# Altium schematic sheet Signal Conditioning.SchDoc
size A4; SheetNumber: 4; SheetTotal: 4
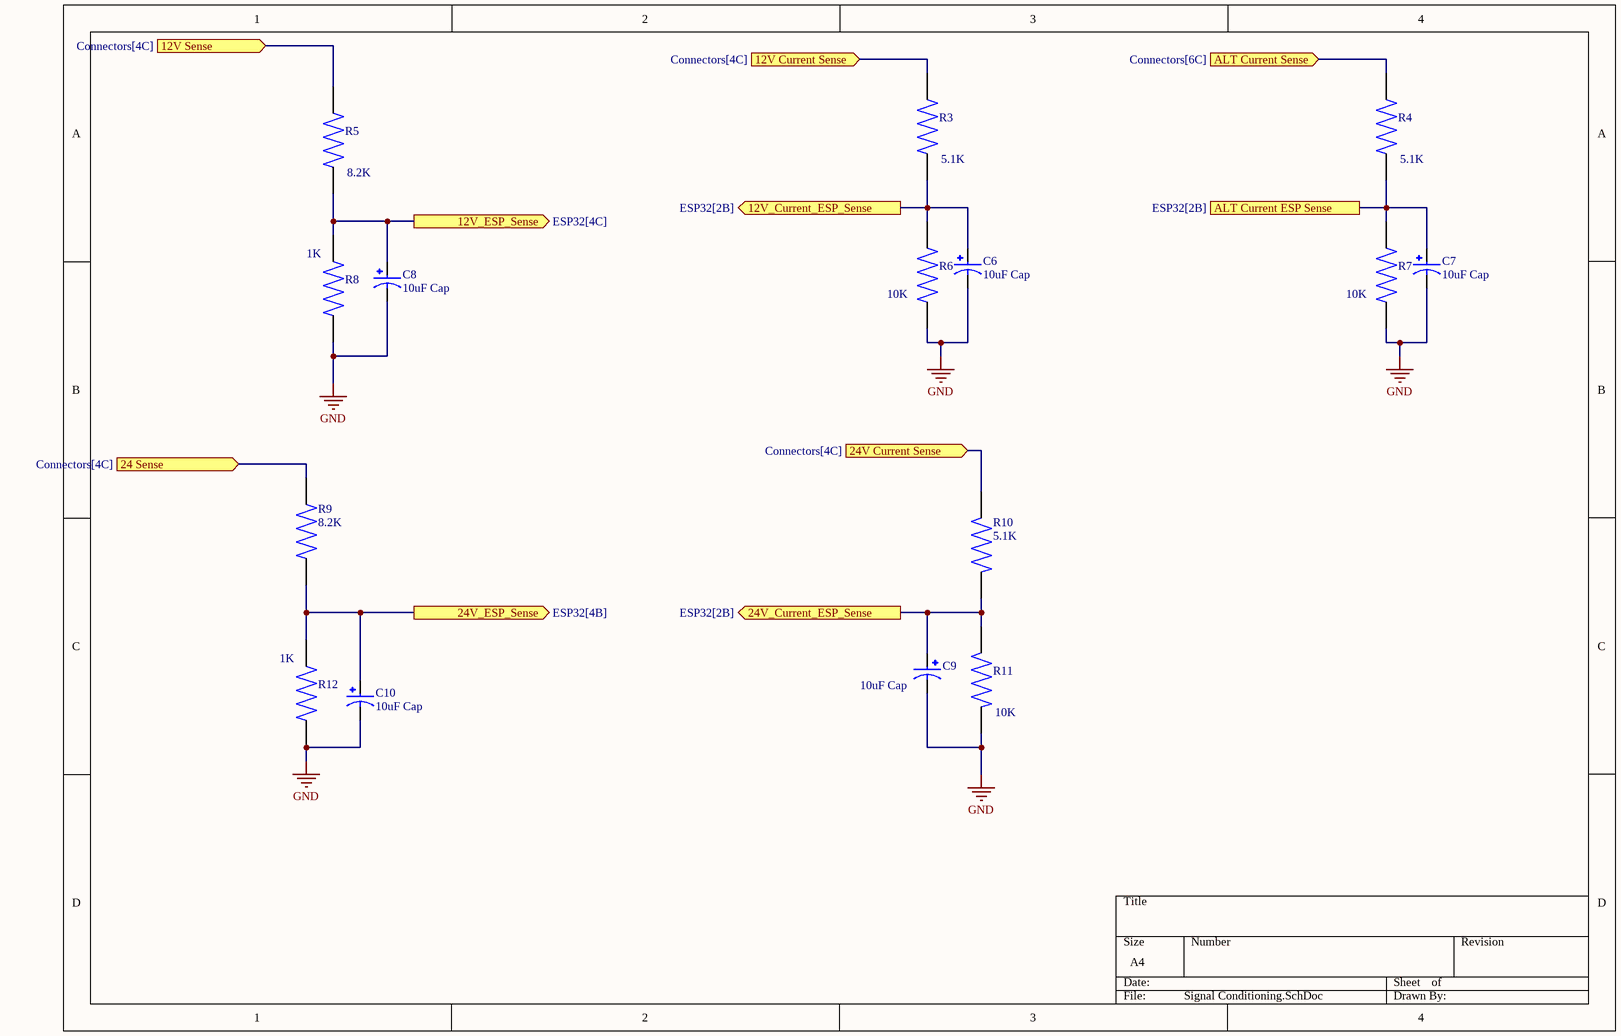
[diagram p0: Signal Conditioning.SchDoc]

## Parts
C6  10uF Cap  [CAP_10uF]
C7  10uF Cap  [CAP_10uF]
C8  10uF Cap  [CAP_10uF]
C9  10uF Cap  [CAP_10uF]
C10  10uF Cap  [CAP_10uF]
R3  5.1K  [Resistor_Through Hole]
R4  5.1K  [Resistor_Through Hole]
R5  8.2K  [Resistor_Through Hole]
R6  10K  [Resistor_Through Hole]
R7  10K  [Resistor_Through Hole]
R8  1K  [Resistor_Through Hole]
R9  8.2K  [Resistor_Through Hole]
R10  5.1K  [Resistor_Through Hole]
R11  10K  [Resistor_Through Hole]
R12  1K  [Resistor_Through Hole]

## Ports
12V Current Sense (in, see Connectors[4C]), 12V Sense (in, see Connectors[4C]), 12V_Current_ESP_Sense (out, see ESP32[2B]), 12V_ESP_Sense (out, see ESP32[4C]), 24 Sense (in, see Connectors[4C]), 24V Current Sense (in, see Connectors[4C]), 24V_Current_ESP_Sense (out, see ESP32[2B]), 24V_ESP_Sense (out, see ESP32[4B]), ALT Current ESP Sense (see ESP32[2B]), ALT Current Sense (in, see Connectors[6C])

## Nets
GND: C6.N C7.N C8.N C9.N C10.N R6.1 R7.1 R8.1 R11.1 R12.1
12V Current Sense: R3.2 ; port 12V Current Sense
12V Sense: R5.2 ; port 12V Sense
12V_Current_ESP_Sense: C6.P R3.1 R6.2 ; port 12V_Current_ESP_Sense
12V_ESP_Sense: C8.P R5.1 R8.2 ; port 12V_ESP_Sense
24 Sense: R9.1 ; port 24 Sense
24V Current Sense: R10.2 ; port 24V Current Sense
24V_Current_ESP_Sense: C9.P R10.1 R11.2 ; port 24V_Current_ESP_Sense
24V_ESP_Sense: C10.P R9.2 R12.2 ; port 24V_ESP_Sense
ALT Current ESP Sense: C7.P R4.1 R7.2 ; port ALT Current ESP Sense
ALT Current Sense: R4.2 ; port ALT Current Sense

## Library data of the parts
C6-C10 = 10uF Cap: CAP ALUM 10UF 20% 50V RADIAL; MP: ECE-A1HN100UI; MF: Panasonic; SnapEDA_Link: https://www.snapeda.com/parts/ECE-A1HN100UI/Panasonic/view-part/2321690/?ref=snap; Price: None; Check_prices: https://www.snapeda.com/parts/ECE-A1HN100UI/Panasonic/view-part/2321690/?ref=eda; Value: *; Availability: In Stock; Package: RADIAL-2 Panasonic
R3-R12 = Resistor_Through Hole: 1.02 Ohms Â±1% 0.25W, 1/4W Through Hole Resistor Axial Metal Film; MP: MFR-25FTE52-1R; MF: Yageo; Availability: Warning; Value: *; Check_prices: https://www.snapeda.com/parts/MFR-25FTE52-1R/Yageo/view-part/4629919/?ref=eda; Package: Axial Yageo; Price: None; SnapEDA_Link: https://www.snapeda.com/parts/MFR-25FTE52-1R/Yageo/view-part/4629919/?ref=snap; Purchase-URL: https://pricing.snapeda.com/search/part/MFR-25FTE52-1R/?ref=eda